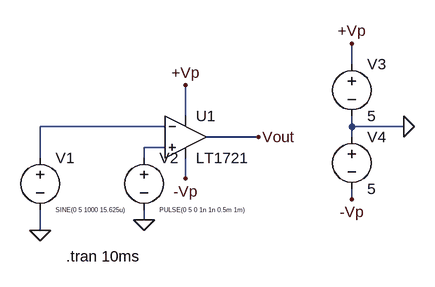
[diagram p0: schematic Pulse width modulation.asc]
Pulse width modulation.asc, the LTspice schematic file:
Version 4.1
SHEET 1 880 680
WIRE 448 48 448 16
WIRE 192 128 192 80
WIRE 160 144 -32 144
WIRE 448 144 448 128
WIRE 528 144 448 144
WIRE 304 160 224 160
WIRE 448 160 448 144
WIRE 160 176 128 176
WIRE -32 192 -32 144
WIRE 128 192 128 176
WIRE 192 224 192 192
WIRE 448 256 448 240
WIRE 128 288 128 272
WIRE -32 304 -32 272
FLAG 192 80 +Vp
FLAG 192 224 -Vp
FLAG 128 288 0
FLAG 304 160 Vout
FLAG 528 144 0
FLAG 448 16 +Vp
FLAG 448 256 -Vp
FLAG -32 304 0
SYMBOL Comparators\\LT1721 192 96 R0
SYMATTR InstName U1
SYMBOL voltage -32 176 R0
WINDOW 3 24 96 Left 0
WINDOW 123 0 0 Left 0
WINDOW 39 0 0 Left 0
SYMATTR InstName V1
SYMATTR Value SINE(0 5 1000 15.625u)
SYMBOL voltage 128 176 R0
WINDOW 3 24 96 Left 0
WINDOW 123 0 0 Left 0
WINDOW 39 0 0 Left 0
SYMATTR InstName V2
SYMATTR Value PULSE(0 5 0 1n 1n 0.5m 1m)
SYMBOL voltage 448 32 R0
WINDOW 123 0 0 Left 0
WINDOW 39 0 0 Left 0
SYMATTR InstName V3
SYMATTR Value 5
SYMBOL voltage 448 144 R0
WINDOW 123 0 0 Left 0
WINDOW 39 0 0 Left 0
SYMATTR InstName V4
SYMATTR Value 5
TEXT 8 344 Left 2 !.tran 10ms

The netlist it stands for:
* Pulse width modulation.asc
X§U1 N002 N001 +Vp -Vp Vout LT1720  ; LT1721, pins In+ In- V+ V- OUT
V1 N001 0 SINE(0 5 1000 15.625u)
V2 N002 0 PULSE(0 5 0 1n 1n 0.5m 1m)
V3 +Vp 0 5
V4 0 -Vp 5
.tran 10ms
.lib LTC.lib
.backanno
.end